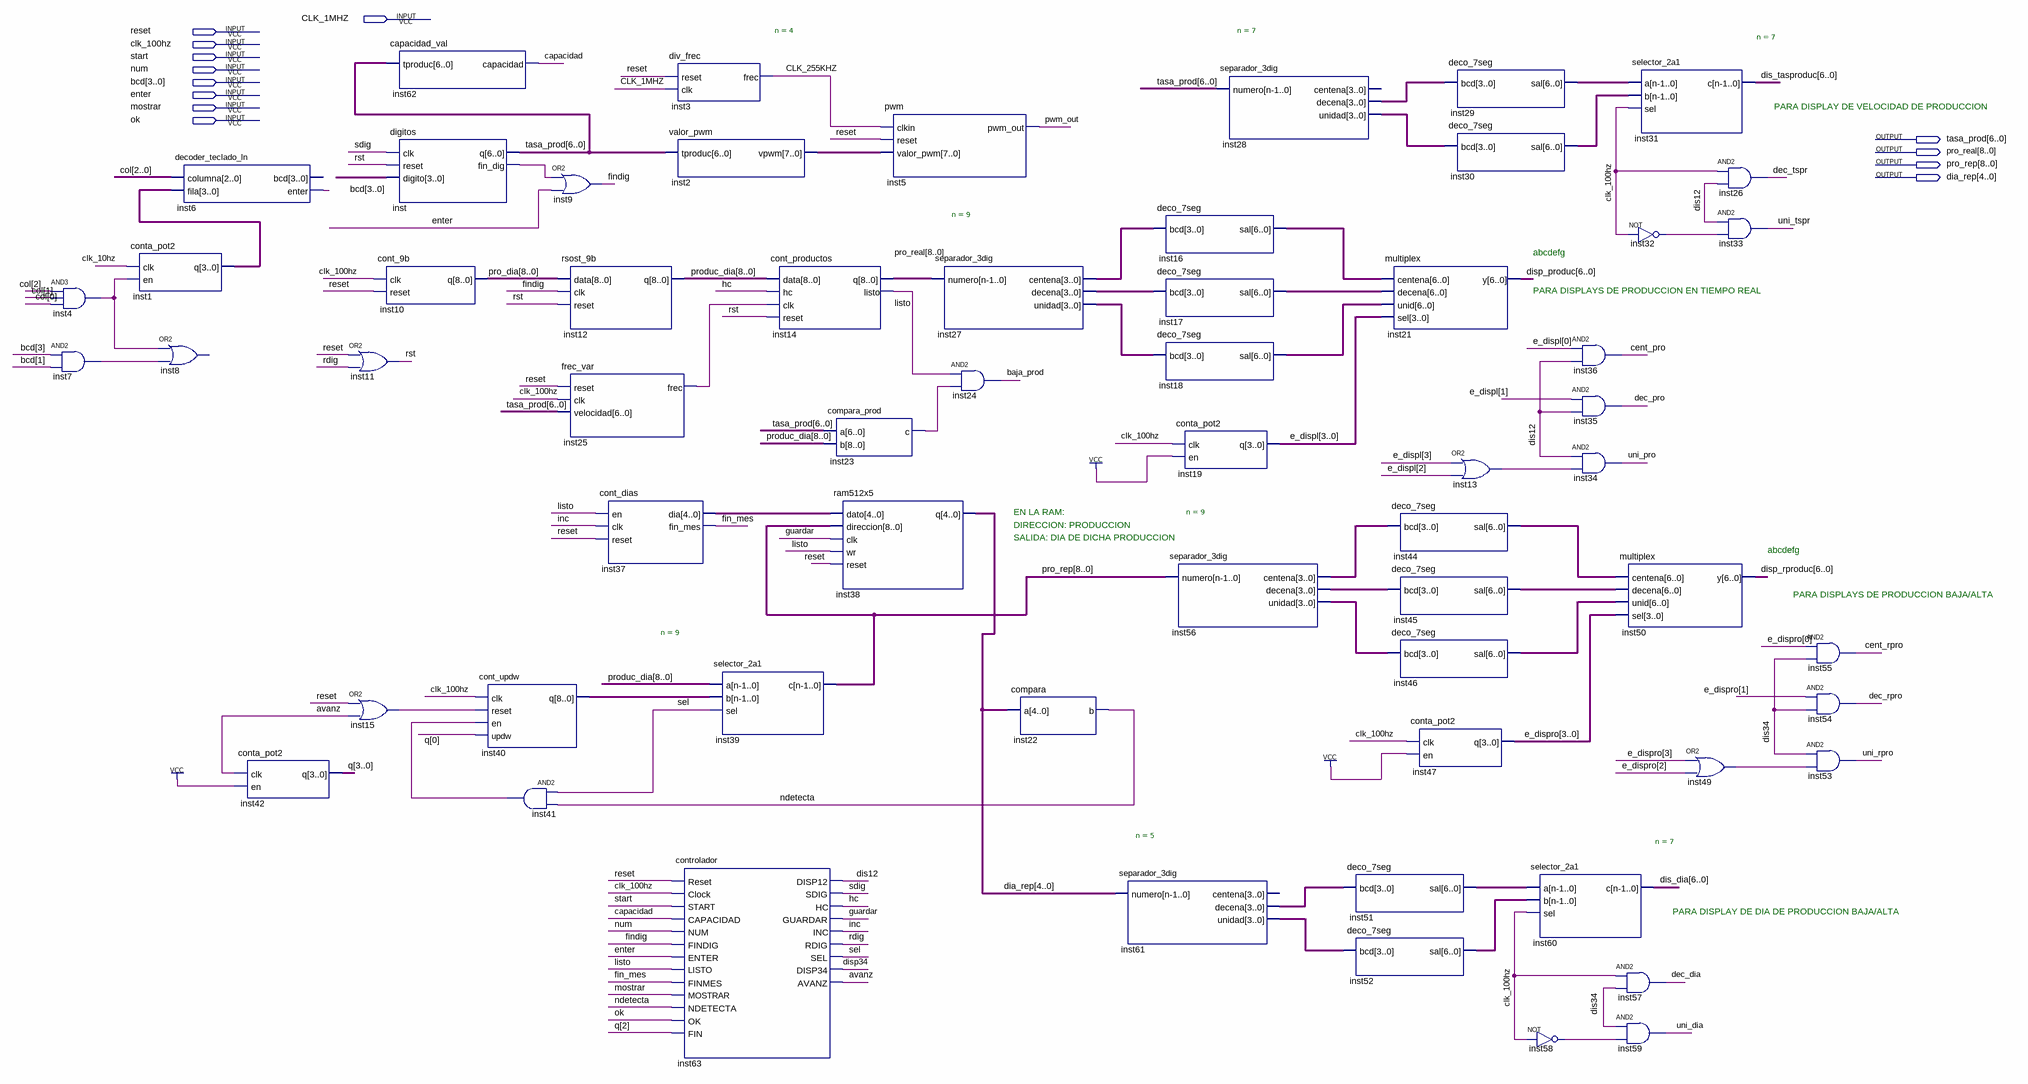
[diagram p0: schematic sheet]
// Quartus schematic CONTROL_PRODUCCION_SIMULAR.bdf as structural Verilog: 61 symbols, 13 pins
module CONTROL_PRODUCCION_SIMULAR (
  input  CLK_1MHZ,
  input  reset,
  input  clk_100hz,
  input  start,
  input  num,
  input  [3:0] bcd,
  input  enter,
  input  mostrar,
  input  ok,
  output [6:0] tasa_prod,
  output [8:0] pro_real,
  output [8:0] pro_rep,
  output [4:0] dia_rep
);

  wire avanz, baja_prod, capacidad, cent_pro, cent_rpro, clk_10hz, CLK_255KHZ, dec_dia, dec_pro, dec_rpro,
       dec_tspr, dis12, dis34, disp34, fin_mes, findig, guardar, hc, inc, inst4_out, inst6_enter, inst7_out,
       inst13_out, inst15_out, inst23_c, inst25_frec, inst32_out, inst41_out, inst49_out, inst58_out,
       inst_fin_dig, listo, ndetecta, pwm_out, rdig, rst, sdig, sel, uni_dia, uni_pro, uni_rpro, uni_tspr;
  wire [2:0] col;
  wire [3:0] e_displ, e_dispro, inst1_q, inst27_centena, inst27_decena, inst27_unidad, inst28_decena,
       inst28_unidad, inst56_centena, inst56_decena, inst56_unidad, inst61_decena, inst61_unidad, q;
  wire [4:0] inst37_dia;
  wire [6:0] dis_dia, dis_tasproduc, disp_produc, disp_rproduc, inst16_sal, inst17_sal, inst18_sal,
       inst29_sal, inst30_sal, inst44_sal, inst45_sal, inst46_sal, inst51_sal, inst52_sal;
  wire [7:0] inst2_vpwm;
  wire [8:0] inst40_q, pro_dia, produc_dia;

  and inst4 (inst4_out, col[2], col[1], col[0]);
  and inst7 (inst7_out, bcd[3], bcd[1]);
  conta_pot2 inst1 (.clk(clk_10hz), .en(inst4_out), .q(inst1_q));
  decoder_teclado_ln inst6 (.columna(col), .fila(inst1_q), .enter(inst6_enter));  // open: bcd
  // OR2 inst8 has open pins: IN1=inst4_out, IN2=inst7_out, OUT=open
  conta_pot2 inst42 (.clk(avanz), .en(1'b1), .q(q));
  cont_9b inst10 (.clk(clk_100hz), .reset(reset), .q(pro_dia));
  or inst11 (rst, reset, rdig);
  or inst15 (inst15_out, reset, avanz);
  capacidad_val inst62 (.tproduc(tasa_prod), .capacidad(capacidad));
  digitos inst (.clk(sdig), .reset(rst), .digito(bcd), .q(tasa_prod), .fin_dig(inst_fin_dig));
  cont_updw inst40 (.clk(clk_100hz), .reset(inst15_out), .en(inst41_out), .updw(q[0]), .q(inst40_q));
  and inst41 (inst41_out, sel, ndetecta);
  or inst9 (findig, inst_fin_dig, enter);
  rsost_9b inst12 (.data(pro_dia), .clk(findig), .reset(rst), .q(produc_dia));
  frec_var inst25 (.reset(reset), .clk(clk_100hz), .velocidad(tasa_prod), .frec(inst25_frec));
  cont_dias inst37 (.en(listo), .clk(inc), .reset(reset), .dia(inst37_dia), .fin_mes(fin_mes));
  div_frec #(.n(4)) inst3 (.reset(reset), .clk(CLK_1MHZ), .frec(CLK_255KHZ));
  valor_pwm inst2 (.tproduc(tasa_prod), .vpwm(inst2_vpwm));
  controlador inst63 (
    .Reset(reset), .Clock(clk_100hz), .START(start), .CAPACIDAD(capacidad), .NUM(num), .FINDIG(findig),
    .ENTER(enter), .LISTO(listo), .FINMES(fin_mes), .MOSTRAR(mostrar), .NDETECTA(ndetecta), .OK(ok),
    .FIN(q[2]), .DISP12(dis12), .SDIG(sdig), .HC(hc), .GUARDAR(guardar), .INC(inc), .RDIG(rdig), .SEL(sel),
    .DISP34(disp34), .AVANZ(avanz));
  selector_2a1 #(.n(9)) inst39 (.a(produc_dia), .b(inst40_q), .sel(sel), .c(pro_rep));
  cont_productos inst14 (.data(produc_dia), .hc(hc), .clk(inst25_frec), .reset(rst), .q(pro_real), .listo(listo));
  compara_prod inst23 (.a(tasa_prod), .b(produc_dia), .c(inst23_c));
  ram512x5 inst38 (.dato(inst37_dia), .direccion(pro_rep), .clk(guardar), .wr(listo), .reset(reset), .q(dia_rep));
  pwm inst5 (.clkin(CLK_255KHZ), .reset(reset), .valor_pwm(inst2_vpwm), .pwm_out(pwm_out));
  separador_3dig #(.n(9)) inst27 (
    .numero(pro_real), .centena(inst27_centena), .decena(inst27_decena), .unidad(inst27_unidad));
  and inst24 (baja_prod, listo, inst23_c);
  compara inst22 (.a(dia_rep), .b(ndetecta));
  separador_3dig #(.n(5)) inst61 (.numero(dia_rep), .decena(inst61_decena), .unidad(inst61_unidad));  // open: centena
  deco_7seg inst16 (.bcd(inst27_centena), .sal(inst16_sal));
  deco_7seg inst17 (.bcd(inst27_decena), .sal(inst17_sal));
  deco_7seg inst18 (.bcd(inst27_unidad), .sal(inst18_sal));
  conta_pot2 inst19 (.clk(clk_100hz), .en(1'b1), .q(e_displ));
  separador_3dig #(.n(9)) inst56 (
    .numero(pro_rep), .centena(inst56_centena), .decena(inst56_decena), .unidad(inst56_unidad));
  separador_3dig #(.n(7)) inst28 (.numero(tasa_prod), .decena(inst28_decena), .unidad(inst28_unidad));  // open: centena
  deco_7seg inst51 (.bcd(inst61_decena), .sal(inst51_sal));
  deco_7seg inst52 (.bcd(inst61_unidad), .sal(inst52_sal));
  multiplex inst21 (.centena(inst16_sal), .decena(inst17_sal), .unid(inst18_sal), .sel(e_displ), .y(disp_produc));
  deco_7seg inst44 (.bcd(inst56_centena), .sal(inst44_sal));
  deco_7seg inst45 (.bcd(inst56_decena), .sal(inst45_sal));
  deco_7seg inst46 (.bcd(inst56_unidad), .sal(inst46_sal));
  deco_7seg inst29 (.bcd(inst28_decena), .sal(inst29_sal));
  deco_7seg inst30 (.bcd(inst28_unidad), .sal(inst30_sal));
  conta_pot2 inst47 (.clk(clk_100hz), .en(1'b1), .q(e_dispro));
  or inst13 (inst13_out, e_displ[3], e_displ[2]);
  selector_2a1 #(.n(7)) inst60 (.a(inst51_sal), .b(inst52_sal), .sel(clk_100hz), .c(dis_dia));
  not inst58 (inst58_out, clk_100hz);
  and inst36 (cent_pro, e_displ[0], dis12);
  and inst35 (dec_pro, e_displ[1], dis12);
  and inst34 (uni_pro, dis12, inst13_out);
  selector_2a1 #(.n(7)) inst31 (.a(inst29_sal), .b(inst30_sal), .sel(clk_100hz), .c(dis_tasproduc));
  not inst32 (inst32_out, clk_100hz);
  multiplex inst50 (.centena(inst44_sal), .decena(inst45_sal), .unid(inst46_sal), .sel(e_dispro), .y(disp_rproduc));
  and inst57 (dec_dia, clk_100hz, dis34);
  and inst59 (uni_dia, dis34, inst58_out);
  or inst49 (inst49_out, e_dispro[3], e_dispro[2]);
  and inst26 (dec_tspr, clk_100hz, dis12);
  and inst33 (uni_tspr, dis12, inst32_out);
  and inst55 (cent_rpro, e_dispro[0], dis34);
  and inst54 (dec_rpro, e_dispro[1], dis34);
  and inst53 (uni_rpro, dis34, inst49_out);

  // Notes on the sheet:
  //   PARA DISPLAY DE VELOCIDAD DE PRODUCCION
  //   abcdefg
  //   PARA DISPLAYS DE PRODUCCION EN TIEMPO REAL
  //   EN LA RAM:
  //   DIRECCION: PRODUCCION
  //   SALIDA: DIA DE DICHA PRODUCCION
  //   abcdefg
  //   PARA DISPLAYS DE PRODUCCION BAJA/ALTA
  //   PARA DISPLAY DE DIA DE PRODUCCION BAJA/ALTA
endmodule
